# Altium schematic sheet arduino.SchDoc
size A4
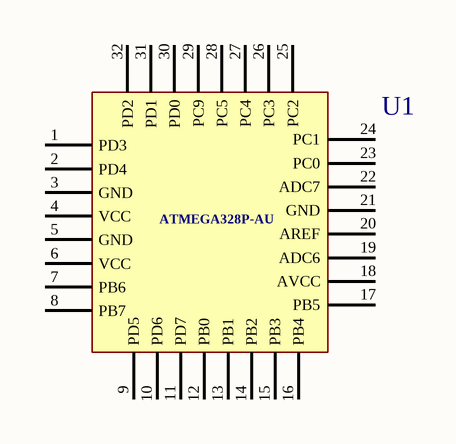
[diagram p0: arduino.SchDoc]

## Parts
U1  ATMEGA328P-AU  [Atmega_328_P-AU]  (value not drawn)

## Nets

Not connected (* = marked no-connect by the designer): U1 1(PD3) 2(PD4) 3(GND) 4(VCC) 5(GND) 6(VCC) 7(PB6) 8(PB7) 9(PD5) 10(PD6) 11(PD7) 12(PB0) 13(PB1) 14(PB2) 15(PB3) 16(PB4) 17(PB5) 18(AVCC) 19(ADC6) 20(AREF) 21(GND) 22(ADC7) 23(PC0) 24(PC1) 25(PC2) 26(PC3) 27(PC4) 28(PC5) 29(PC9) 30(PD0) 31(PD1) 32(PD2)

## Library data of the parts
U1 = ATMEGA328P-AU: 8-bit AVR Microcontroller with 32K Bytes In-System / Programmable Flash; Creator: Gaurav Kumar; Date: 08-09-21